# EAGLE schematic TinkerKit-concept (EAGLE 7.5.0)
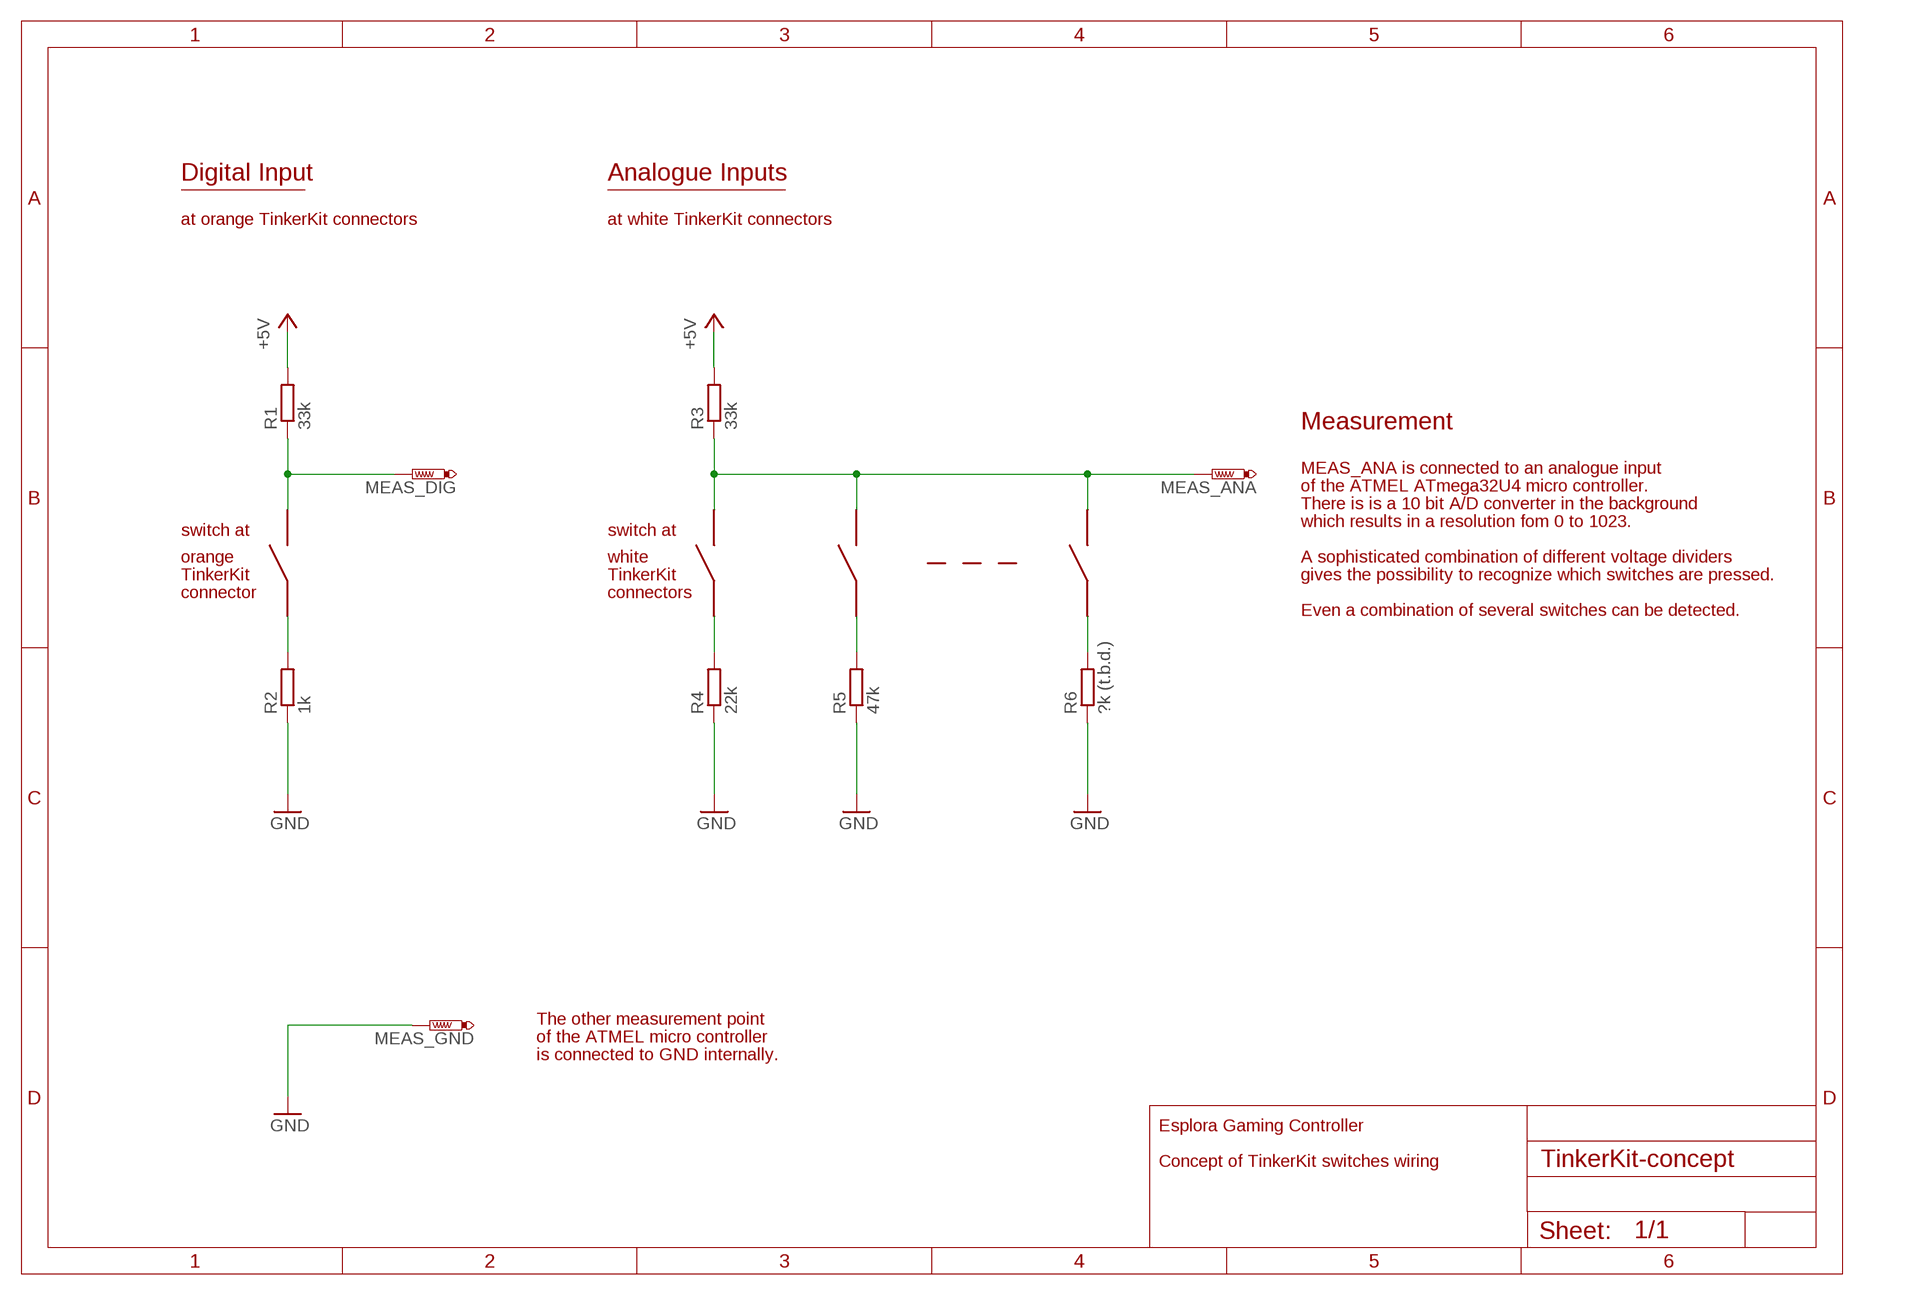
[diagram p0: schematic, sheet 1]

## Parts
MEAS_ANA  PTR1B1,27  [B1,27]
MEAS_DIG  PTR1B1,27  [B1,27]
MEAS_GND  PTR1B1,27  [B1,27]
R1  33k  R-EU_M1206  [M1206]
R2  1k  R-EU_M1206  [M1206]
R3  33k  R-EU_M1206  [M1206]
R4  22k  R-EU_M1206  [M1206]
R5  47k  R-EU_M1206  [M1206]
R6  ?k (t.b.d.)  R-EU_M1206  [M1206]

## Nets
+5V: R1.2 R3.2
GND: MEAS_GND.TP R2.1 R4.1 R5.1 R6.1
N$1: R2.2
N$2: MEAS_DIG.TP R1.1
N$3: R4.2
N$4: MEAS_ANA.TP R3.1
N$5: R5.2
N$7: R6.2

## Notes on the sheet
- Digital Input | Analogue Inputs
- at orange TinkerKit connectors | at white TinkerKit connectors
- Measurement
- MEAS_ANA is connected to an analogue input
- of the ATMEL ATmega32U4 micro controller.
- There is is a 10 bit A/D converter in the background
- which results in a resolution fom 0 to 1023.
- switch at | switch at
- orange | white | A sophisticated combination of different voltage dividers
- TinkerKit | TinkerKit | gives the possibility to recognize which switches are pressed.
- connector | connectors
- Even a combination of several switches can be detected.
- The other measurement point
- of the ATMEL micro controller
- is connected to GND internally.
- Esplora Gaming Controller
- Concept of TinkerKit switches wiring

## Library data of the parts
MEAS_ANA MEAS_DIG MEAS_GND = testpad:PTR1: TEST PIN
R1-R6 = rcl:R-EU_: RESISTOR, European symbol